# EAGLE design Codeshelf-0008 (EAGLE 6.5.0)
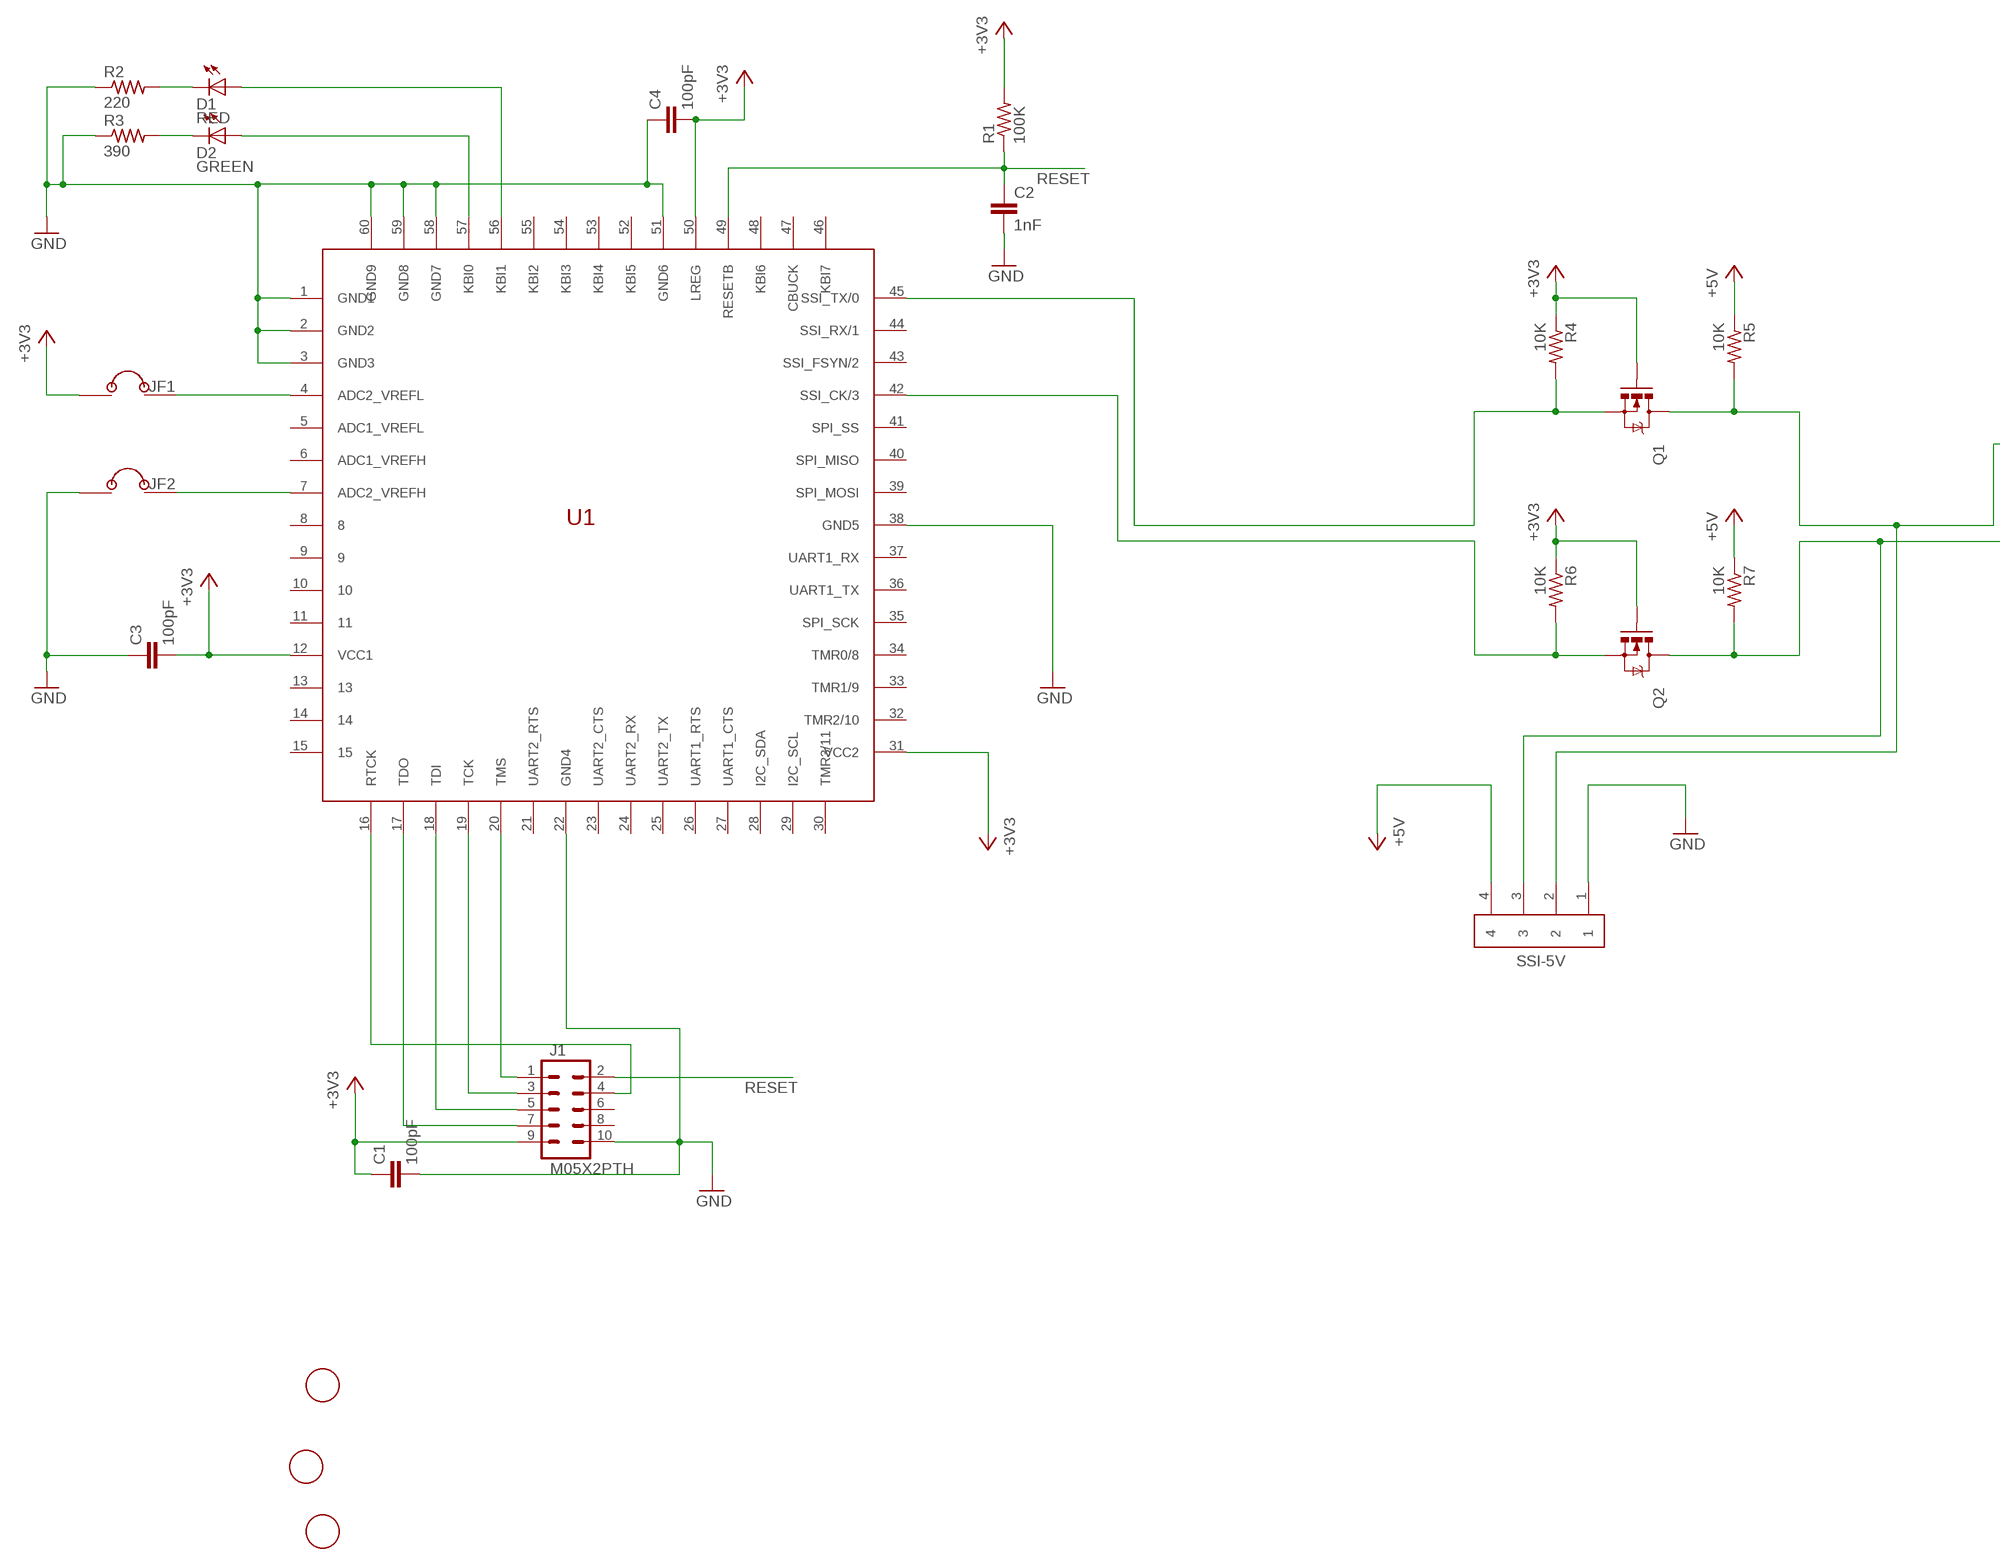
[diagram p0: schematic, sheet 1, part 1 of 2]
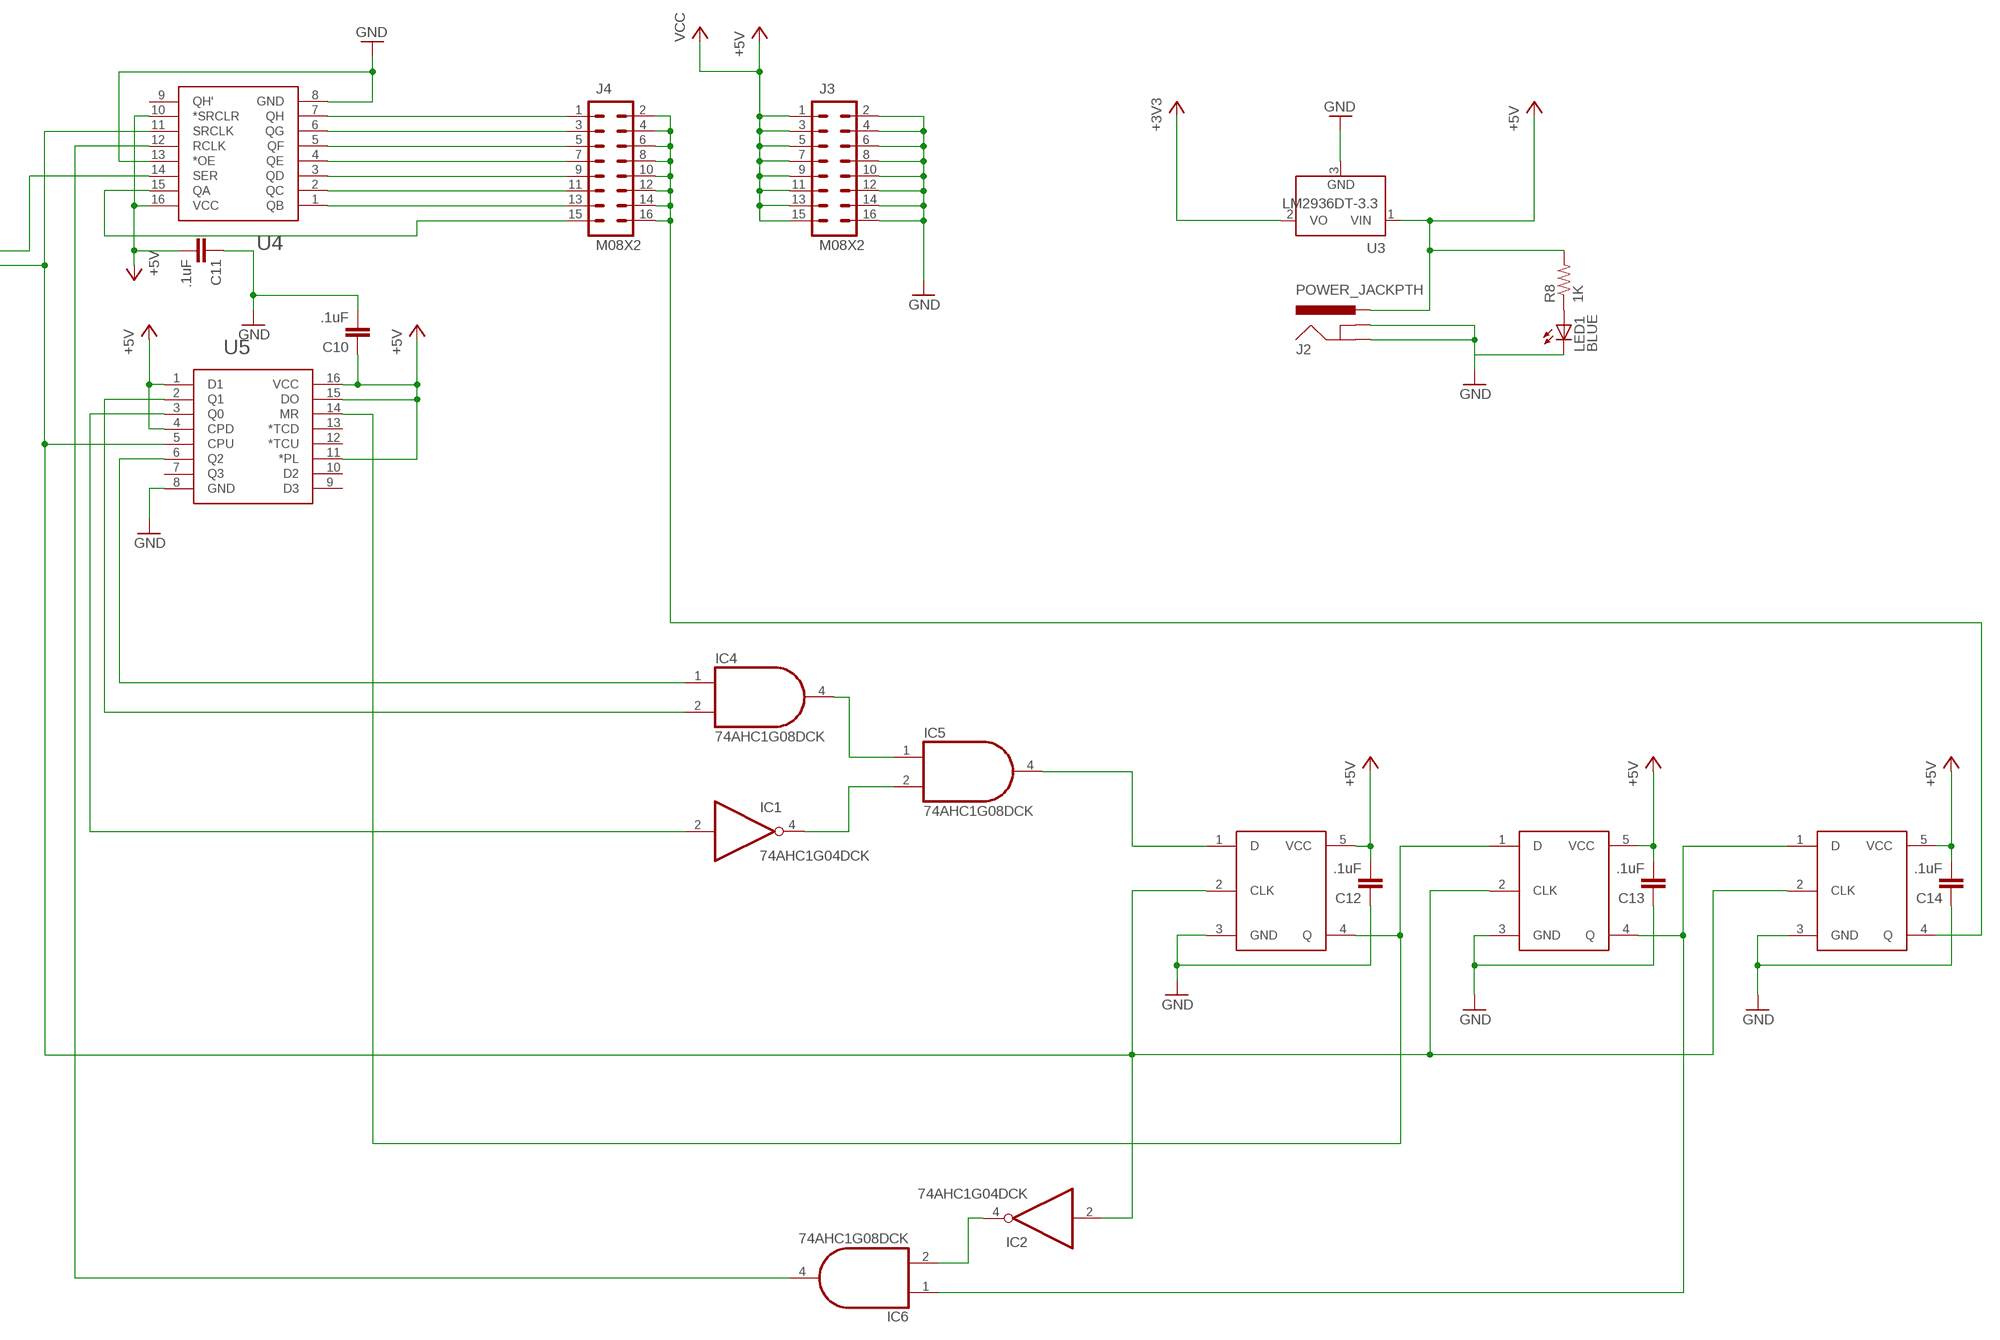
[diagram p1: schematic, sheet 1, part 2 of 2]

## Parts
C1  100pF  RF-C0603  [C0603]
C2  1nF  RF-C0603  [C0603]
C3  100pF  RF-C0603  [C0603]
C4  100pF  RF-C0603  [C0603]
C10  .1uF  RF-C0402  [C0402]
C11  .1uF  RF-C0402  [C0402]
C12  .1uF  RF-C0402  [C0402]
C13  .1uF  RF-C0402  [C0402]
C14  .1uF  RF-C0402  [C0402]
D1  RED  LEDCHIP-LED0805  [CHIP-LED0805]
D2  GREEN  LEDCHIP-LED0805  [CHIP-LED0805]
IC1  74AHC1G04DCK  [SC70-5]
IC2  74AHC1G04DCK  [SC70-5]
IC4  74AHC1G08DCK  [SC70-5]
IC5  74AHC1G08DCK  [SC70-5]
IC6  74AHC1G08DCK  [SC70-5]
J1  M05X2PTH  [AVR_ICSP]
J2  POWER_JACKPTH  [POWER_JACK_PTH]
J3  M08X2  [2X8]
J4  M08X2  [2X8]
JF1  JUMPER-2X-SMT-VIA  [JUMPER-VIA-2X]
JF2  JUMPER-2X-SMT-VIA  [JUMPER-VIA-2X]
LED1  BLUE  LED5MM  [LED5MM]
Q1  MOSFET-NCHANNELBSS138  [SOT23]
Q2  MOSFET-NCHANNELBSS138  [SOT23]
R1  100K  RF-R0402  [RF-R0402]
R2  220  RF-R0402  [RF-R0402]
R3  390  RF-R0402  [RF-R0402]
R4  10K  RF-R0402  [RF-R0402]
R5  10K  RF-R0402  [RF-R0402]
R6  10K  RF-R0402  [RF-R0402]
R7  10K  RF-R0402  [RF-R0402]
R8  1K  R-US_0204/7  [0204/7]
SSI-5V  HEADER-4X39357  [MOLEX-39357-0004]
U1  ZSFM201-1A  [ZSFM201-1]
U3  LM2936DT-3.3  [TO252]
U4  SN74HC595PW  [TSSOP16]
U5  74HCT193PW  [TSSOP16]
U6  D-FLIP-FLOP-74LV1G79DBVR  [SOT23-5]
U7  D-FLIP-FLOP-74LV1G79DBVR  [SOT23-5]
U8  D-FLIP-FLOP-74LV1G79DBVR  [SOT23-5]
U$2  FIDUCIAL  [FIDUCIAL_1MM]
U$3  FIDUCIAL  [FIDUCIAL_1MM]
U$4  FIDUCIAL  [FIDUCIAL_1MM]

## Nets
+3V3 [3v3]: C1.1 C3.2 C4.2 J1.9 JF1.1 Q1.1(G) Q2.1(G) R1.2 R4.1 R6.1 U1.12(VCC1) U1.31(VCC2) U1.50(LREG) U3.2(VO)
+5V [5V]: C10.1 C11.2 C12.2 C13.2 C14.2 J2.PWR J3.1 J3.3 J3.5 J3.7 J3.9 J3.11 J3.13 J3.15 R5.1 R7.1 R8.2 SSI-5V.4 U3.1(VIN) U4.10(*SRCLR) U4.16(VCC) U5.1(D1) U5.4(CPD) U5.11(*PL) U5.15(DO) U5.16(VCC) U6.5(VCC) U7.5(VCC) U8.5(VCC) ; supply symbol labelled VCC
GND [GND]: C1.2 C2.2 C3.1 C4.1 C10.2 C11.1 C12.1 C13.1 C14.1 J1.10 J2.GND J2.GNDBREAK J3.2 J3.4 J3.6 J3.8 J3.10 J3.12 J3.14 J3.16 JF2.1 LED1.K(C) R2.1 R3.1 SSI-5V.1 U1.1(GND1) U1.2(GND2) U1.3(GND3) U1.22(GND4) U1.38(GND5) U1.51(GND6) U1.58(GND7) U1.59(GND8) U1.60(GND9) U3.3(GND) U4.8(GND) U4.13(*OE) U5.8(GND) U6.3(GND) U7.3(GND) U8.3(GND)
N$1: D2.A U1.57(KBI0)
N$2: D1.A U1.56(KBI1)
N$3: D2.C R3.2
N$4: D1.C R2.2
N$5: LED1.A R8.1
N$6: JF2.2 U1.7(ADC2_VREFH)
N$7: JF1.2 U1.4(ADC2_VREFL)
N$10: J4.13 U4.1(QB)
N$13: J4.11 U4.2(QC)
N$14: J4.9 U4.3(QD)
N$16: J4.7 U4.4(QE)
N$17: J4.5 U4.5(QF)
N$18: J4.3 U4.6(QG)
N$19: J4.1 U4.7(QH)
N$20: J4.15 U4.15(QA)
N$22: IC1.4(O) IC5.2(I1)
N$23: IC4.4(O) IC5.1(I0)
N$24: IC5.4(O) U6.1(D)
N$25: U5.14(MR) U6.4(Q) U7.1(D)
N$26: IC6.1(I0) U7.4(Q) U8.1(D)
N$28: IC2.4(O) IC6.2(I1)
N$29: IC1.2(I) U5.3(Q0)
N$30: IC4.2(I1) U5.2(Q1)
N$31: IC4.1(I0) U5.6(Q2)
N$33: IC6.4(O) U4.12(RCLK)
RESET: C2.1 J1.2 R1.1 U1.49(RESETB)
RTCK: J1.4 U1.16(RTCK)
SSI-CLK: J4.2 J4.4 J4.6 J4.8 J4.10 J4.12 J4.14 J4.16 U8.4(Q)
SSI-CLK-3V3: Q2.2(S) R6.2 U1.42(SSI_CK/3)
SSI-CLK-5V: IC2.2(I) Q2.3(D) R7.2 SSI-5V.3 U4.11(SRCLK) U5.5(CPU) U6.2(CLK) U7.2(CLK) U8.2(CLK)
SSI-TX-3V3: Q1.2(S) R4.2 U1.45(SSI_TX/0)
SSI-TX-5V: Q1.3(D) R5.2 SSI-5V.2 U4.14(SER)
TCK: J1.3 U1.19(TCK)
TDI: J1.5 U1.18(TDI)
TDO: J1.7 U1.17(TDO)
TMS: J1.1 U1.20(TMS)
Unconnected: J1.6 J1.8 U1.5(ADC1_VREFL) U1.6(ADC1_VREFH) U1.8 U1.9 U1.10 U1.11 U1.13 U1.14 U1.15 U1.21(UART2_RTS) U1.23(UART2_CTS) U1.24(UART2_RX) U1.25(UART2_TX) U1.26(UART1_RTS) U1.27(UART1_CTS) U1.28(I2C_SDA) U1.29(I2C_SCL) U1.30(TMR3/11) U1.32(TMR2/10) U1.33(TMR1/9) U1.34(TMR0/8) U1.35(SPI_SCK) U1.36(UART1_TX) U1.37(UART1_RX) U1.39(SPI_MOSI) U1.40(SPI_MISO) U1.41(SPI_SS) U1.43(SSI_FSYN/2) U1.44(SSI_RX/1) U1.46(KBI7) U1.47(CBUCK) U1.48(KBI6) U1.52(KBI5) U1.53(KBI4) U1.54(KBI3) U1.55(KBI2) U4.9(QH') U5.7(Q3) U5.9(D3) U5.10(D2) U5.12(*TCU) U5.13(*TCD)

## Power pins joined to a net without a drawn wire
+5V: IC1.5(VCC) IC2.5(VCC) IC4.5(VCC) IC5.5(VCC) IC6.5(VCC)
GND: IC1.3(GND) IC2.3(GND) IC4.3(GND) IC5.3(GND) IC6.3(GND)

## Library data of the parts
C1 C3 C4 = GW-devices:RF-C: RF capacitor pads for FSL reference design; MFGN: Murata; MFGP: C0603C101K5RACTU
C2 = GW-devices:RF-C: RF capacitor pads for FSL reference design; MFGN: Murata; MFGP: C0603C102K4RACTU
C10-C14 = GW-devices:RF-C: RF capacitor pads for FSL reference design; MFGN: Murata; MFGP: GRM155R61C104KA88D; PRICE: 0.03
D1 = led:LED: LED OSRAM: - CHIPLED LG R971, LG N971, LY N971, LG Q971, LY Q971, LO R971, LY R971 LH N974, LH R974 LS Q976, LO Q976, LY Q976 LO Q996 - Hyper CHIPLED LW Q18S LB Q993, LB Q99A, LB R99A - SideLED LS A670, LO A670, LY A670, LG A670, LP A670 LB A673, LV A673, LT A673, LW A673 LH A674 LY A675 LS A676, LA A676, LO A676, LY A676, LW A676 LS A679, LY A679, LG A679 - Hyper Micro SIDELED® LS Y876, LA Y876, LO Y876, LY Y876 LT Y87S - SmartLED LW L88C, LW L88S LB L89C, LB L89S, LG L890 LS L89K, LO L89K, LY L89K LS L896, LA L896, LO L896, LY L896 - TOPLED LS T670, LO T670, LY T670, LG T670, LP T670 LSG T670, LSP T670, LSY T670, LOP T670, LYG T670 LG T671, LOG T671, LSG T671 LB T673, LV T673, LT T673, LW T673 LH T674 LS T676, LA T676, LO T676, LY T676, LB T676, LH T676, LSB T676, LW T676 LB T67C, LV T67C, LT T67C, LS T67K, LO T67K, LY T67K, LW E67C LS E67B, LA E67B, LO E67B, LY E67B, LB E67C, LV E67C, LT E67C LW T67C LS T679, LY T679, LG T679 LS T770, LO T770, LY T770, LG T770, LP T770 LB T773, LV T773, LT T773, LW T773 LH T774 LS E675, LA E675, LY E675, LS T675 LS T776, LA T776, LO T776, LY T776, LB T776 LHGB T686 LT T68C, LB T68C - Hyper Mini TOPLED® LB M676 - Mini TOPLED Santana® LG M470 LS M47K, LO M47K, LY M47K Source: http://www.osram.convergy.de LUXEON: - LUMILED® LXK2-PW12-R00, LXK2-PW12-S00, LXK2-PW14-U00, LXK2-PW14-V00 LXK2-PM12-R00, LXK2-PM12-S00, LXK2-PM14-U00 LXK2-PE12-Q00, LXK2-PE12-R00, LXK2-PE12-S00, LXK2-PE14-T00, LXK2-PE14-U00 LXK2-PB12-K00, LXK2-PB12-L00, LXK2-PB12-M00, LXK2-PB14-N00, LXK2-PB14-P00, LXK2-PB14-Q00 LXK2-PR12-L00, LXK2-PR12-M00, LXK2-PR14-Q00, LXK2-PR14-R00 LXK2-PD12-Q00, LXK2-PD12-R00, LXK2-PD12-S00 LXK2-PH12-R00, LXK2-PH12-S00 LXK2-PL12-P00, LXK2-PL12-Q00, LXK2-PL12-R00 Source: www.luxeon.com KINGBRIGHT: KA-3528ASYC Source: www.kingbright.com; MFGN: OSRAM; MFGP: Q62702P5182; NOTES: DNP
D2 = led:LED: LED OSRAM: - CHIPLED LG R971, LG N971, LY N971, LG Q971, LY Q971, LO R971, LY R971 LH N974, LH R974 LS Q976, LO Q976, LY Q976 LO Q996 - Hyper CHIPLED LW Q18S LB Q993, LB Q99A, LB R99A - SideLED LS A670, LO A670, LY A670, LG A670, LP A670 LB A673, LV A673, LT A673, LW A673 LH A674 LY A675 LS A676, LA A676, LO A676, LY A676, LW A676 LS A679, LY A679, LG A679 - Hyper Micro SIDELED® LS Y876, LA Y876, LO Y876, LY Y876 LT Y87S - SmartLED LW L88C, LW L88S LB L89C, LB L89S, LG L890 LS L89K, LO L89K, LY L89K LS L896, LA L896, LO L896, LY L896 - TOPLED LS T670, LO T670, LY T670, LG T670, LP T670 LSG T670, LSP T670, LSY T670, LOP T670, LYG T670 LG T671, LOG T671, LSG T671 LB T673, LV T673, LT T673, LW T673 LH T674 LS T676, LA T676, LO T676, LY T676, LB T676, LH T676, LSB T676, LW T676 LB T67C, LV T67C, LT T67C, LS T67K, LO T67K, LY T67K, LW E67C LS E67B, LA E67B, LO E67B, LY E67B, LB E67C, LV E67C, LT E67C LW T67C LS T679, LY T679, LG T679 LS T770, LO T770, LY T770, LG T770, LP T770 LB T773, LV T773, LT T773, LW T773 LH T774 LS E675, LA E675, LY E675, LS T675 LS T776, LA T776, LO T776, LY T776, LB T776 LHGB T686 LT T68C, LB T68C - Hyper Mini TOPLED® LB M676 - Mini TOPLED Santana® LG M470 LS M47K, LO M47K, LY M47K Source: http://www.osram.convergy.de LUXEON: - LUMILED® LXK2-PW12-R00, LXK2-PW12-S00, LXK2-PW14-U00, LXK2-PW14-V00 LXK2-PM12-R00, LXK2-PM12-S00, LXK2-PM14-U00 LXK2-PE12-Q00, LXK2-PE12-R00, LXK2-PE12-S00, LXK2-PE14-T00, LXK2-PE14-U00 LXK2-PB12-K00, LXK2-PB12-L00, LXK2-PB12-M00, LXK2-PB14-N00, LXK2-PB14-P00, LXK2-PB14-Q00 LXK2-PR12-L00, LXK2-PR12-M00, LXK2-PR14-Q00, LXK2-PR14-R00 LXK2-PD12-Q00, LXK2-PD12-R00, LXK2-PD12-S00 LXK2-PH12-R00, LXK2-PH12-S00 LXK2-PL12-P00, LXK2-PL12-Q00, LXK2-PL12-R00 Source: www.luxeon.com KINGBRIGHT: KA-3528ASYC Source: www.kingbright.com; MFGN: OSRAM; MFGP: LG R971-KN-1; NOTES: DNP
IC1 IC2 = 74xx-little-us:74*1G04: INVERTER Gate; MFGN: NXP; MFGP: 74LVC1GU04GW; PRICE: 0.25
IC4-IC6 = 74xx-little-us:74*1G08: 2-input AND gate; MFGN: Diodes, Inc; MFGP: 74LVC1G08SE; PRICE: 0.38
J1 = SparkFun:M05X2: Header 5x2 Standard 10-pin dual row 0.1" header. Commonly used with AVR-ISP. Use with Spark Fun Electronics SKU: PRT-00778; NOTES: DNP - flashing header
J2 = GW-devices:POWER_JACK: Power Jack This is the standard 5.5mm barrel jack for power. The PTH is the most common, proven, reliable, footprint. All others are experimental. The Slot footprint only works if the mill layer is transmitted to the PCB fab house so be warned. Spark Fun Electronics SKU : PRT-00119. Mating wall wart : TOL-00298 (and others); MFGN: Kobiconn; MFGP: 163-7620-E
J3 J4 = SparkFun:M08X2; NOTES: DNP - optional channels
JF1 JF2 = GW-devices:JUMPER-2X: This kind of jumper provides a place to place to put "green wires" for jumpering fetaure/options.; NOTES: DNP - flashing jumper
LED1 = led:LED: LED OSRAM: - CHIPLED LG R971, LG N971, LY N971, LG Q971, LY Q971, LO R971, LY R971 LH N974, LH R974 LS Q976, LO Q976, LY Q976 LO Q996 - Hyper CHIPLED LW Q18S LB Q993, LB Q99A, LB R99A - SideLED LS A670, LO A670, LY A670, LG A670, LP A670 LB A673, LV A673, LT A673, LW A673 LH A674 LY A675 LS A676, LA A676, LO A676, LY A676, LW A676 LS A679, LY A679, LG A679 - Hyper Micro SIDELED® LS Y876, LA Y876, LO Y876, LY Y876 LT Y87S - SmartLED LW L88C, LW L88S LB L89C, LB L89S, LG L890 LS L89K, LO L89K, LY L89K LS L896, LA L896, LO L896, LY L896 - TOPLED LS T670, LO T670, LY T670, LG T670, LP T670 LSG T670, LSP T670, LSY T670, LOP T670, LYG T670 LG T671, LOG T671, LSG T671 LB T673, LV T673, LT T673, LW T673 LH T674 LS T676, LA T676, LO T676, LY T676, LB T676, LH T676, LSB T676, LW T676 LB T67C, LV T67C, LT T67C, LS T67K, LO T67K, LY T67K, LW E67C LS E67B, LA E67B, LO E67B, LY E67B, LB E67C, LV E67C, LT E67C LW T67C LS T679, LY T679, LG T679 LS T770, LO T770, LY T770, LG T770, LP T770 LB T773, LV T773, LT T773, LW T773 LH T774 LS E675, LA E675, LY E675, LS T675 LS T776, LA T776, LO T776, LY T776, LB T776 LHGB T686 LT T68C, LB T68C - Hyper Mini TOPLED® LB M676 - Mini TOPLED Santana® LG M470 LS M47K, LO M47K, LY M47K Source: http://www.osram.convergy.de LUXEON: - LUMILED® LXK2-PW12-R00, LXK2-PW12-S00, LXK2-PW14-U00, LXK2-PW14-V00 LXK2-PM12-R00, LXK2-PM12-S00, LXK2-PM14-U00 LXK2-PE12-Q00, LXK2-PE12-R00, LXK2-PE12-S00, LXK2-PE14-T00, LXK2-PE14-U00 LXK2-PB12-K00, LXK2-PB12-L00, LXK2-PB12-M00, LXK2-PB14-N00, LXK2-PB14-P00, LXK2-PB14-Q00 LXK2-PR12-L00, LXK2-PR12-M00, LXK2-PR14-Q00, LXK2-PR14-R00 LXK2-PD12-Q00, LXK2-PD12-R00, LXK2-PD12-S00 LXK2-PH12-R00, LXK2-PH12-S00 LXK2-PL12-P00, LXK2-PL12-Q00, LXK2-PL12-R00 Source: www.luxeon.com KINGBRIGHT: KA-3528ASYC Source: www.kingbright.com; MFGN: Cree Inc; MFGP: C503B-BCN-CV0Z0461
Q1 Q2 = SparkFun-DiscreteSemi:MOSFET-NCHANNEL: Common NMOSFET Parts MFG P/N Store ID Prod ID FDD8780 TRANS-09984 SI7820DN TRANS-11055 FDS6630A IC-08089 2N7002PW TRANS-11151 FQP30N06L COM-10213 TRANS-10060 BSS123LT1G TRANS-08345 BSS138 TRANS-00830 BS170 2N7000; MFGN: Diodes Inc; MFGP: BSS138TA; PRICE: 0.54; PROD_ID: TRANS-00830
R1 = GW-devices:RF-R: RF resistor pads for FSL reference design; MFGN: Panasonic; MFGP: ERJ-2GEJ104X
R2 = GW-devices:RF-R: RF resistor pads for FSL reference design; MFGN: Panasonic; MFGP: ERJ-2GEJ224X; NOTES: DNP
R3 = GW-devices:RF-R: RF resistor pads for FSL reference design; MFGN: Panasonic; MFGP: ERJ-2GEJ394X; NOTES: DNP
R4-R7 = GW-devices:RF-R: RF resistor pads for FSL reference design; MFGN: Panasonic; MFGP: ERJ-2GEJ103X
R8 = rcl:R-US_: RESISTOR, American symbol; MFGN: Stackpole Electronics Inc; MFGP: CF18JT1K00
SSI-5V = GW-devices:HEADER-4X: 4 position pin header; MFGN: Molex; MFGP: 39357-0004; PRICE: 1.00
U1 = GW-devices:ZSFM201-1: The CEL MC13224V; MFGN: CEL; MFGP: ZFSM-201-1C; PRICE: 29.00
U3 = national-semiconductor:LM2936?*: Ultra-Low Quiescent Current LDO Voltage Regulator Source: Data sheet <http://www.national.com/ds/LM/LM2936.pdf>; MFGN: STM Electronics; MFGP: L4931ABDT33-TR; MPN: LM2936DT-3.3.; OC_FARNELL: 1286863; OC_NEWARK: 26M0361; PRICE: 1.00
U4 = GW-devices:SN74HC595PW; MFGN: TI; MFGP: SN74HC595PWR; PRICE: 0.31
U5 = GW-devices:74HCT193PW; MFGN: NXP; MFGP: 74HCT193PW; PRICE: 0.60
U6-U8 = GW-devices:D-FLIP-FLOP; MFGN: TI; MFGP: SN74LVC1G79DBVR; PRICE: 0.27
U$2-U$4 = adafruit:FIDUCIAL: For use by pick and place machines to calibrate the vision/machine, 1mm By microbuilder.eu

## Net classes
1 3v3: width 0.5 mm
2 5V: width 0.4 mm
4 GND: width 0.5 mm
5 RS485: width 0.4 mm

## Board
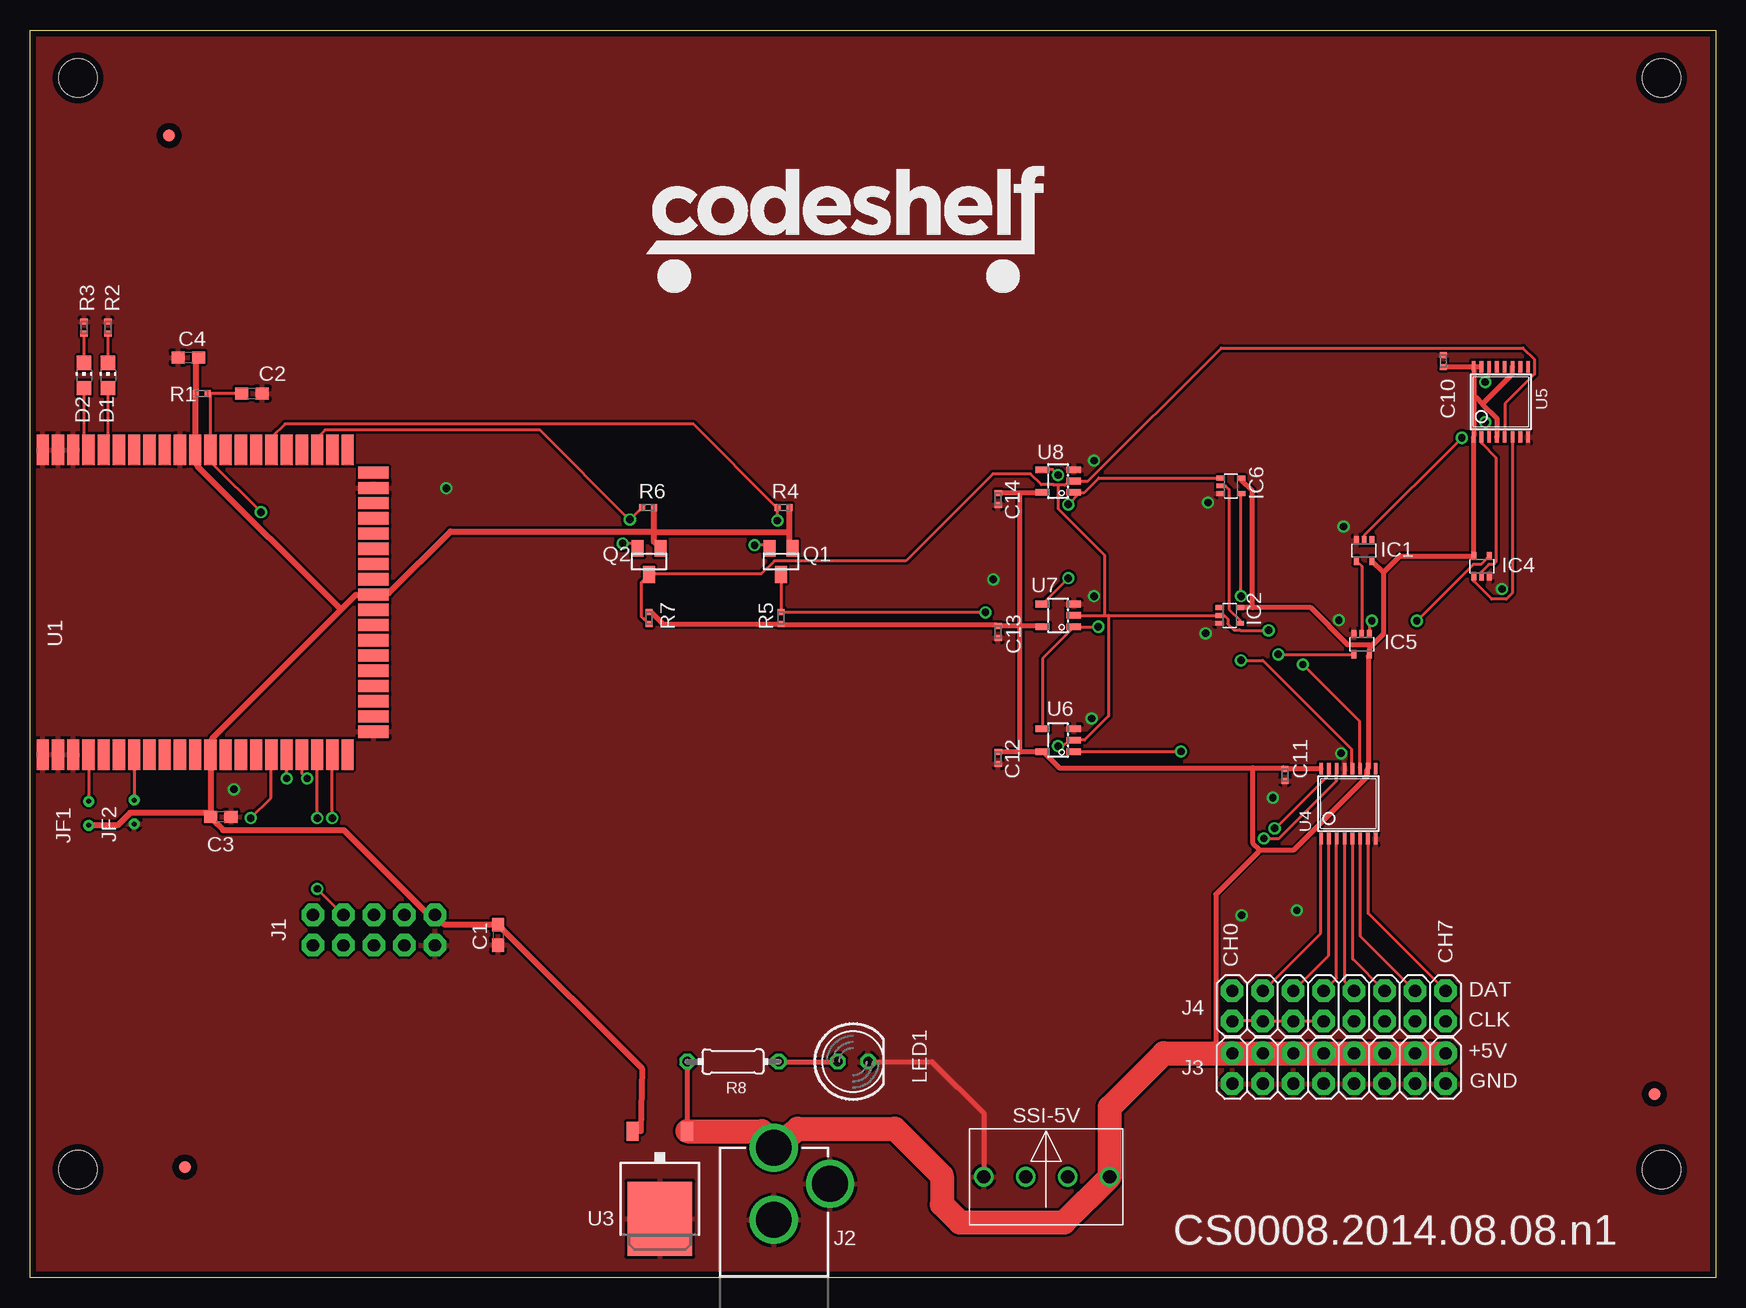
[diagram p2: board, top side]
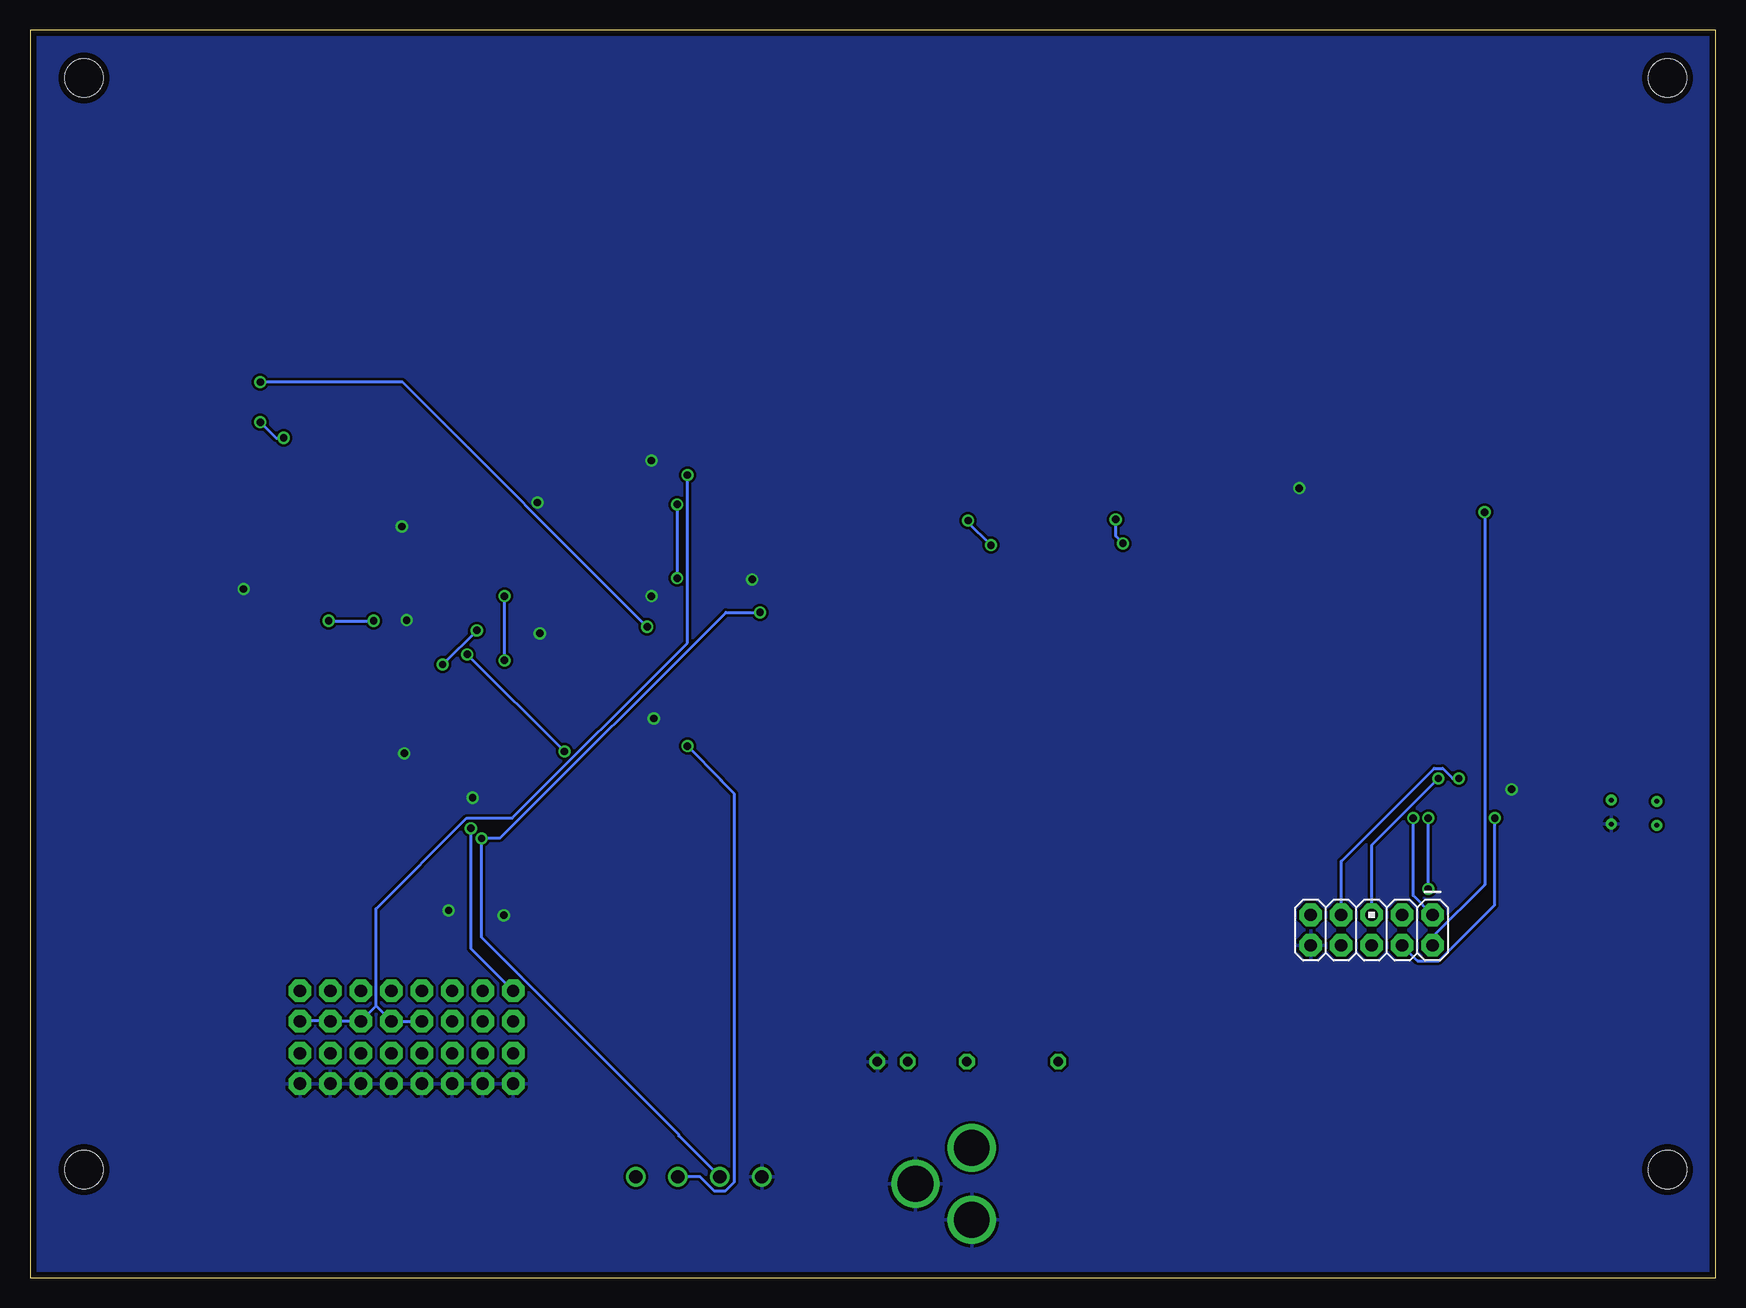
[diagram p3: board, bottom side, seen from below]

Size 140.5 x 104 mm. Coordinates in mm from the lower left corner, seen from the top.
Outline: 0,0 0,104 140.5,104 140.5,0 0,0
Copper layers (1*16): Top 0.035mm / dielectric 1.5mm / Bottom 0.035mm
Design rules "default *": minimum track width 10mil, minimum drill 24mil, track to track 8mil, track to pad 8mil, pad to pad 8mil, via to via 8mil, smd to smd 8mil, copper to edge 20mil, drill to drill 8mil, minimum pad ring 10mil, minimum via ring 8mil, stop-mask expansion 4mil, vias tented up to drill 0mil, thermal gap 10mil
Holes 3.2 mm at 4,100 136,100 4,9 136,9

### Footprints (pad centres in the part's own frame; a part is rotated, then mirrored left to right if it is on the bottom)
C0603 = smd 1.1 x 1: 1 -0.85,0; 2 0.85,0
C0402 = smd 0.5 x 0.6: 1 -0.5,0; 2 0.5,0
CHIP-LED0805 = smd 1.2 x 1.2: A 0,-1.05; C 0,1.05
SC70-5 = smd 0.4 x 0.7: 1 -0.65,-0.85; 2 0,-0.85; 3 0.65,-0.85; 4 0.65,0.85; 5 -0.65,0.85
AVR_ICSP = drill 1.016 pad 1.88 octagon: 1 -1.27,5.08; 2 1.27,5.08; 3 -1.27,2.54; 4 1.27,2.54; 5 -1.27,0; 6 1.27,0; 7 -1.27,-2.54; 8 1.27,-2.54; 9 -1.27,-5.08; 10 1.27,-5.08
POWER_JACK_PTH = drill 2.997: GND 0,7.7; GNDBREAK 4.7,10.7; PWR 0,13.7
2X8 = drill 1.016 pad 1.88 octagon: 1 0,0; 2 0,2.54; 3 2.54,0; 4 2.54,2.54; 5 5.08,0; 6 5.08,2.54; 7 7.62,0; 8 7.62,2.54; 9 10.16,0; 10 10.16,2.54; 11 12.7,0; 12 12.7,2.54; 13 15.24,0; 14 15.24,2.54; 15 17.78,0; 16 17.78,2.54
JUMPER-VIA-2X = drill 0.4: 1 -1,0; 2 1,0
LED5MM = drill 0.813 octagon: A -1.27,0; K 1.27,0
SOT23 = smd 1 x 1.4: 1 -0.95,-1.1; 2 0.95,-1.1; 3 0,1.1
RF-R0402 = smd 0.5 x 0.6: 1 -0.5,0; 2 0.5,0
0204/7 = drill 0.813 octagon: 1 -3.81,0; 2 3.81,0
MOLEX-39357-0004 = drill 1.1: 1 -5.2,0; 2 -1.7,0; 3 1.8,0; 4 5.3,0
ZSFM201-1 = smd 2.54 x 1.016: 1 -12.7,28.829; 2 -12.7,27.559; 3 -12.7,26.289; 4 -12.7,25.019; 5 -12.7,23.749; 6 -12.7,22.479; 7 -12.7,21.209; 8 -12.7,19.939; 9 -12.7,18.669; 10 -12.7,17.399; 11 -12.7,16.129; 12 -12.7,14.859; 13 -12.7,13.589; 14 -12.7,12.319; 15 -12.7,11.049; 16 -12.7,9.779; 17 -12.7,8.509; 18 -12.7,7.239; 19 -12.7,5.969; 20 -12.7,4.699; 21 -12.7,3.429; 40 12.7,3.429; 41 12.7,4.699; 42 12.7,5.969; 43 12.7,7.239; 44 12.7,8.509; 45 12.7,9.779; 46 12.7,11.049; 47 12.7,12.319; 48 12.7,13.589; 49 12.7,14.859; 50 12.7,16.129; 51 12.7,17.399; 52 12.7,18.669; 53 12.7,19.939; 54 12.7,21.209; 55 12.7,22.479; 56 12.7,23.749; 57 12.7,25.019; 58 12.7,26.289; 59 12.7,27.559; 60 12.7,28.829 | smd 1.016 x 2.54: 22 -10.795,1.27; 23 -9.525,1.27; 24 -8.255,1.27; 25 -6.985,1.27; 26 -5.715,1.27; 27 -4.445,1.27; 28 -3.175,1.27; 29 -1.905,1.27; 30 -0.635,1.27; 31 0.635,1.27; 32 1.905,1.27; 33 3.175,1.27; 34 4.445,1.27; 35 5.715,1.27; 36 6.985,1.27; 37 8.255,1.27; 38 9.525,1.27; 39 10.795,1.27
TO252 = smd 1 x 1.6: 1 -2.28,-4.8; 2 2.28,-4.8 | smd 5.4 x 6.2: 3 0,2.5
TSSOP16 = smd 0.305 x 0.991: 1 -2.275,-2.918; 2 -1.625,-2.918; 3 -0.975,-2.918; 4 -0.325,-2.918; 5 0.325,-2.918; 6 0.975,-2.918; 7 1.625,-2.918; 8 2.275,-2.918; 9 2.275,2.918; 10 1.625,2.918; 11 0.975,2.918; 12 0.325,2.918; 13 -0.325,2.918; 14 -0.975,2.918; 15 -1.625,2.918; 16 -2.275,2.918
SOT23-5 = smd 0.55 x 1.2: 1 -0.95,-1.3; 2 0,-1.3; 3 0.95,-1.3; 4 0.95,1.3; 5 -0.95,1.3
FIDUCIAL_1MM = smd 1 x 1: 1 0,0

### Placement (x,y rotation side)
C1  39.01,28.56 270 top
C2  18.5,73.7 0 top
C3  15.9,38.4 180 top
C4  13.2,76.7 0 top
C10  117.8,76.4 90 top
C11  104.6,41.9 90 top
C12  80.7,43.3 90 top
C13  80.7,53.8 90 top
C14  80.7,64.9 90 top
D1  6.5,75.2 0 top
D2  4.5,75.2 0 top
IC1  111.2,60.6 180 top
IC2  100,55.2 270 top
IC4  121,59.3 0 top
IC5  111,52.8 180 top
IC6  100.1,66 270 top
J1  28.67,28.96 270 bottom
J2  62,-2.9 0 top
J3  118,18.7 180 top
J4  118,23.9 180 top
JF1  4.9,38.7 90 top
JF2  8.7,38.8 90 top
LED1  68.6,18 0 top
Q1  62.6,59.7 180 top
Q2  51.6,59.7 180 top
R1  14.3,73.7 180 top
R2  6.5,79.2 270 top
R3  4.5,79.2 270 top
R4  62.8,64.2 180 top
R5  62.6,55 90 top
R6  51.5,64.2 180 top
R7  51.6,55 270 top
R8  58.6,18 180 top
SSI-5V  84.7,8.4 0 top
U1  29.9,56.3 90 top
U3  52.5,7.4 180 top
U4  109.9,39.5 0 top
U5  122.6,73 0 top
U6  85.7,44.8 90 top
U7  85.7,55.2 90 top
U8  85.7,66.4 90 top
U$1  [CODESHELF-LOGO]  51.4,82.1 0 top
U$2  12.9,9.2 0 top
U$3  11.6,95.2 0 top
U$4  135.4,15.3 0 top

### Tracks (layer width: path | path; a pad name or v marks a point on that pad's centre or on a via)
+3V3
  Top 0.5: U3.2 50.9,12.2 51,17.45 39.2,29.25 C1.1 39,29.45 34.5,29.45 33.75,30.2 J1.9 33.55,30.35 33.1,30.35 26.15,37.3 16.1,37.3 15.2,38.2 C3.2 | 52,62.1 52,61.35 Q2.1 | 52,62.1 52,62.2 | 52,62.2 R6.1 | 63.3,62.1 63.3,61.05 Q1.1 | 63.3,62.1 R4.1 | 63.3,62.1 52,62.1 | C4.2 13.8,76.45 R1.2 13.8,69 U1.50 13.95,68.8 13.95,67.65 25.93,55.67 | C3.2 U1.12 15.2,43.8 15.2,44.95 25.93,55.67 | JF1.1 7.3,37.7 8.35,38.75 14.85,38.75 C3.2 | 25.93,55.67 27.15,56.9 28.6,56.9 U1.31 28.85,57.05 29.9,57.05 35.05,62.2 52,62.2
+5V
  Top 0.4: C10.1 120.3,75.9 U5.16 | 120.35,73.4 120.35,75.7 U5.16 | 120.35,73.4 120.35,70.1 U5.1 120.35,69.9 IC4.5 114.2,60.15 112.95,58.9 112.8,58.8 | U5.15 120.95,75.95 120.5,75.95 U5.16 | 121.08,72.83 120.5,73.4 120.35,73.4 | 121.08,72.83 122.25,71.65 122.25,70.1 U5.4 | 121.08,72.83 123.55,75.3 123.55,75.9 U5.11 | 111.78,52.62 112.8,53.65 112.8,58.8 | 111.78,52.62 111.65,52.5 IC5.5 111.55,51.8 111.55,42.45 U4.10 111.45,42.25 111.45,41.75 105.35,35.65 102.5,35.65 | IC1.5 112.8,58.8 | 101.9,55.85 106.75,55.85 109.85,52.75 111.65,52.75 111.78,52.62 | 101.9,55.85 IC2.5 | IC6.5 100.95,66.5 101.9,65.55 101.9,55.85 | R7.1 51.75,55.5 52.75,54.5 R5.1 62.75,54.4 80.55,54.4 C13.2 82.5,54.3 | 82.5,65.4 84.3,65.4 84.35,65.45 U8.5 | 82.5,65.4 C14.2 | 82.5,54.3 84.3,54.3 84.35,54.25 U7.5 | U4.16 107.6,42.4 C11.2 104.45,42.5 101.9,42.5 | 82.5,43.8 84.3,43.8 84.35,43.85 U6.5 84.55,43.75 85.8,42.5 101.9,42.5 | 82.5,43.8 C12.2 | 82.5,43.8 82.5,54.3 | 82.5,54.3 82.5,65.4 | 102.5,35.65 101.9,36.25 101.9,42.5 | 98.85,18.7 98.85,31.95 102.4,35.5 102.5,35.65
  Top 0.406: R8.2 U3.1
  Top 2: U3.1 61,12.2 J2.PWR 64,12.4 72.1,12.4 76,8.5 76,6.1 77.5,4.6 86.2,4.6 SSI-5V.4 90,14.2 94.5,18.7 98.85,18.7 J3.15 J3.13 J3.11 J3.9 J3.7 J3.5 J3.3 J3.1
GND  (via drill 0.61)
  Top 0.406: LED1.K 75.2,18 79.5,13.7 SSI-5V.1
  other vias: 88.7,56.8 88.7,68.1 88.5,46.6 109.3,43.7 109.5,62.6 109.1,54.8 98,53.7 98.2,64.6 122.7,57.4 103.6,40 80.3,58.2 17,40.7 34.7,65.8 105.6,30.6 101,30.2
  pour Bottom: 0,0 0,104 140.5,104 140.5,0
  pour Top: 0,0 0,104 140.5,104 140.5,0
N$1
  Top 0.254: D2.A 4.5,69.35 4.85,69 U1.57
N$2
  Top 0.254: D1.A 6.5,69.3 6.2,69 U1.56
N$3
  Top 0.254: D2.C R3.2
N$4
  Top 0.254: D1.C R2.2
N$5
  Top 0.406: R8.1 LED1.A
N$6
  Top 0.254: JF2.2 U1.7
N$7
  Top 0.254: JF1.2 4.9,43.6 U1.4
N$10
  Top 0.254: U4.1 107.6,36.55 107.6,28.7 102.8,23.9 J4.13
N$13
  Top 0.254: J4.11 108.25,26.85 108.25,36.55 U4.2
N$14
  Top 0.254: U4.3 108.9,36.55 108.9,24.95 J4.9
N$16
  Top 0.254: U4.4 109.6,36.55 109.6,24.65 110.35,23.9 J4.7
N$17
  Top 0.254: U4.5 110.25,36.55 110.25,26.55 112.9,23.9 J4.5
N$18
  Top 0.254: U4.6 110.9,36.55 110.9,28.45 J4.3
N$19
  Top 0.254: J4.1 111.55,30.35 111.55,36.55 U4.7
N$20  (via drill 0.61)
  Top 0.254: v103.75,37.45 103.8,37.45 108.25,41.9 108.25,42.4 U4.15
  Bottom 0.254: v103.75,37.45 103.75,27.4 100.25,23.9 J4.15
N$22
  Top 0.254: IC5.2 111,59.3 IC1.4
N$23  (via drill 0.61)
  Top 0.254: IC5.1 111.65,54.55 v111.85,54.75 | v115.6,54.75 120.3,59.45 120.95,59.45 IC4.4
  Bottom 0.254: v115.6,54.75 v111.85,54.75
N$24  (via drill 0.61)
  Top 0.254: v104.05,51.95 IC5.4 | U6.1 v95.95,43.85
  Bottom 0.254: v95.95,43.85 v104.05,51.95
N$25  (via drill 0.61)
  Top 0.254: v121.3,74.65 121.6,74.95 121.6,75.9 U5.14 | v89.05,54.25 U7.1 86.95,54.15 84.4,51.6 U6.4 | U6.4
  Bottom 0.254: v121.3,74.65 109.45,74.65 v89.05,54.25
N$26  (via drill 0.61)
  Top 0.254: IC6.1 89.1,66.65 87.9,65.45 U8.1 87.45,65.35 v86.55,64.45 | v86.55,58.3 U7.4 | U7.4
  Bottom 0.254: v86.55,64.45 v86.55,58.3
N$28
  Top 0.254: IC2.4 100.85,54.8 99.95,55.7 99.95,65.7 99.65,66 IC6.2
N$29  (via drill 0.61)
  Top 0.254: IC1.2 111.2,61.85 v119.35,70 | v121.3,71.3 121.3,70.9 121.6,70.6 121.6,70.1 U5.3
  Bottom 0.254: v119.35,70 120,70 v121.3,71.3
N$30
  Top 0.254: IC4.2 121,58.85 121.6,59.45 122,59.45 122.2,59.65 122.2,68.35 121,69.55 121,70.05 U5.2
N$31
  Top 0.254: IC4.1 120.35,58.05 121.85,56.55 123.05,56.55 123.55,57.05 123.55,70.05 U5.6
N$33  (via drill 0.61)
  Top 0.254: v100.95,56.8 IC6.4 | 110.2,42.45 U4.12 110.15,42.55 110.15,44.05 102.75,51.45 v100.95,51.45
  Bottom 0.254: v100.95,51.45 v100.95,56.8
RESET  (via drill 0.61)
  Top 0.254: C2.1 15.05,73.7 | 15.05,73.7 R1.1 | 15.05,73.7 U1.49 15.1,68.9 15.1,67.95 v19.25,63.8
  Bottom 0.254: v19.25,63.8 19.25,32.75 23.55,28.45 23.55,27.7 J1.2
RTCK  (via drill 0.61)
  Top 0.254: v18.4,38.3 20.1,40 20.1,43.6 U1.16
  Bottom 0.254: v18.4,38.3 18.4,31.05 23.05,26.4 24.85,26.4 26.1,27.65 J1.4
SSI-CLK  (via drill 0.61)
  Top 0.254: J4.16 100.25,21.4 102.75,21.4 J4.14 102.85,21.4 105.3,21.4 J4.12 105.4,21.4 107.8,21.4 J4.10 | U8.4 85.25,67.35 v85.7,66.9
  Bottom 0.254: v85.7,66.9 85.7,52.9 100.3,38.3 104.1,38.3 111.65,30.75 111.65,22.65 | 111.65,22.65 110.4,21.4 J4.8 110.25,21.35 J4.10 | 111.65,22.65 112.9,21.4 J4.6 113.05,21.35 J4.4 115.55,21.4 118,21.4 J4.2
SSI-CLK-3V3  (via drill 0.61)
  Top 0.254: R6.2 v50,63.2 49.9,63.25 42.5,70.65 24.6,70.65 23.95,70 23.95,69 U1.42 | v49.4,61.2 50.25,61.2 Q2.2
  Bottom 0.254: v50,63.2 50,61.8 v49.4,61.2
SSI-CLK-5V  (via drill 0.61)
  Top 0.254: U7.2 89.55,55.2 | 89.55,55.2 89.9,55.2 | 89.9,55.2 IC2.2 99.25,55.15 99.6,55.15 99.85,54.9 99.85,54.5 100.35,54 100.8,54 100.9,53.95 v103.25,53.95 | 110.85,42.45 U4.11 110.8,42.55 110.8,46.4 v106.1,51.1 | 89.9,55.2 89.9,46.8 87.9,44.8 U6.2 86.9,44.75 86.55,44.75 86.1,44.3 v85.7,44.3 | R7.2 51.2,54.9 51.15,54.9 50.95,55.1 50.95,57.95 Q2.3 51.7,58.65 60.95,58.65 62.05,59.75 73,59.75 80.25,67 83.4,67 84.3,66.1 85.3,66.1 85.35,66.05 85.7,66.05 | U5.5 122.95,70.1 122.95,72.85 125.4,75.3 125.4,76.55 124.45,77.5 99.3,77.5 88.2,66.4 U8.2 86.9,66.35 86.55,66.35 86.25,66.05 85.7,66.05 | 89.55,55.2 89.55,60.25 85.7,64.1 85.7,66.05
  Bottom 0.254: v85.7,44.3 82.9,41.5 82.85,41.4 81.8,40.35 81.8,7.95 82.55,7.2 83.45,7.2 84.65,8.4 SSI-5V.3 | v103.25,53.95 v106.1,51.1
SSI-TX-3V3  (via drill 0.61)
  Top 0.254: v62.3,63.1 R4.2 62.2,64.25 55.3,71.15 21.25,71.15 20.15,70.05 20.15,69 U1.45 | v60.4,61.05 61.4,61.05 Q1.2
  Bottom 0.254: v62.3,63.1 62.3,62.95 v60.4,61.05
SSI-TX-5V  (via drill 0.61)
  Top 0.254: Q1.3 R5.2 62.7,55.45 v79.65,55.45 | v102.85,36.6 104.1,36.6 108.9,41.4 108.9,42.4 U4.14
  Bottom 0.254: v79.65,55.45 82.5,55.45 101.3,36.65 102.75,36.65 v102.85,36.6 102.85,28.35 86.4,11.9 86.4,11.8 SSI-5V.2
TCK  (via drill 0.61)
  Top 0.254: v23.95,38.3 23.95,43.6 U1.19 | v23.95,32.4 26.1,30.25 J1.3
  Bottom 0.254: v23.95,32.4 v23.95,38.3
TDI  (via drill 0.61)
  Top 0.254: v23.1,41.6 22.7,42 22.7,43.6 U1.18
  Bottom 0.254: v23.1,41.6 28.65,36.05 28.65,30.25 J1.5
TDO  (via drill 0.61)
  Top 0.254: v21.4,41.6 U1.17
  Bottom 0.254: v21.4,41.6 21.9,41.6 22.75,42.45 23.45,42.45 31.2,34.7 31.2,30.25 J1.7
TMS  (via drill 0.61)
  Top 0.254: v25.2,38.3 U1.20
  Bottom 0.254: v25.2,38.3 25.2,31.85 23.6,30.25 J1.1

### Text on the board
tPlace: CH0 | CH7 | DAT | CLK | +5V | GND | CS0008.2014.08.08.n1